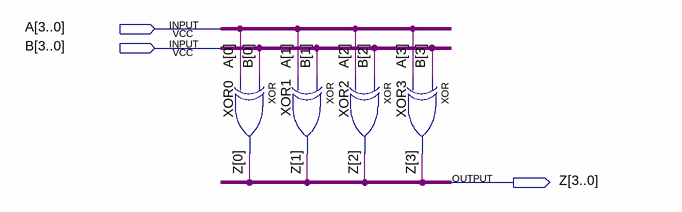
[diagram p0: schematic sheet]
// Quartus schematic XOR30.bdf as structural Verilog: 4 symbols, 3 pins
module XOR30 (
  input  [3:0] A,
  input  [3:0] B,
  output [3:0] Z
);

  xor XOR0 (Z[0], B[0], A[0]);
  xor XOR1 (Z[1], B[1], A[1]);
  xor XOR2 (Z[2], B[2], A[2]);
  xor XOR3 (Z[3], B[3], A[3]);
endmodule
